# Altium schematic sheet 14.SchDoc
size 297 x 209 mm
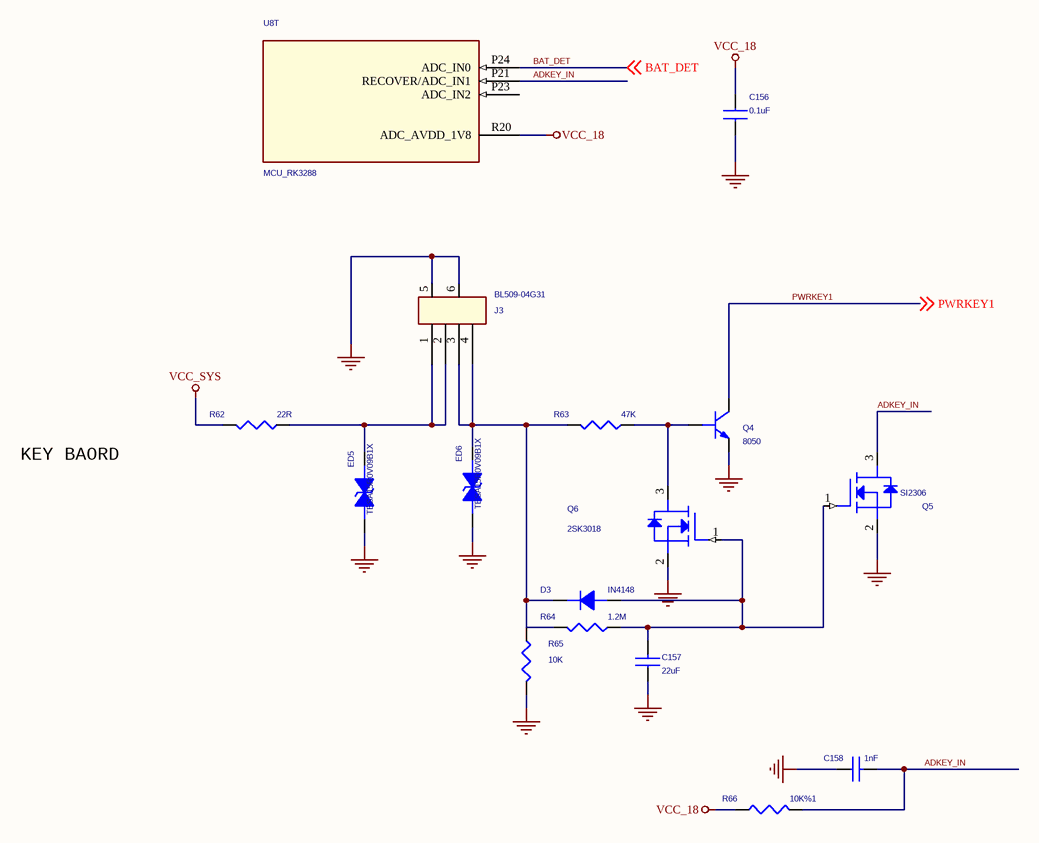
[diagram p0: 14.SchDoc]

## Parts
C156  0.1uF  [C0603]
C157  22uF  [C0402]
C158  1nF  [C0402]
D3  IN4148  [SOD323]
ED5  TESA15R0V09B1X  [E0402N]
ED6  TESA15R0V09B1X  [E0402N]
J3  BL509-04G31  [BL509-04G31]
Q4  8050  [SOT23]
Q5  SI2306  [SOT23]
Q6  2SK3018  [SOT23]
R62  22R  [R0402]
R63  47K  [R0402]
R64  1.2M  [R0402]
R65  10K  [R0402]
R66  10K%1  [R0402]
U8  MCU_RK3288  [BGA453-19X19]  (part T of 24)

## Nets
GND: C156.1 C157.1 C158.1 ED5.2 ED6.2 J3.5 J3.6 Q4.2(E) Q5.2(SOURCE) Q6.2(SOURCE) R65.2
VCC_18: C156.2 R66.1 U8.R20(ADC_AVDD_1V8)
VCC_SYS: R62.2
ADKEY_IN: C158.2 Q5.3(DRAIN) R66.2 U8.P21(RECOVER/ADC_IN1)
BAT_DET: U8.P24(ADC_IN0) ; off-sheet BAT_DET
PWRKEY1: Q4.3(C) ; off-sheet PWRKEY1
NetC157_2: C157.2 D3.1(A) Q5.1(GATE) Q6.1(GATE) R64.1
NetD3_2: D3.2(K) ED6.1 J3.3 J3.4 R63.2 R64.2 R65.1
NetED5_1: ED5.1 J3.1 J3.2 R62.1
NetQ4_1: Q4.1(B) Q6.3(DRAIN) R63.1

Not connected (* = marked no-connect by the designer): U8 P23(ADC_IN2)

## Notes on the sheet
- KEY BAORD

## Library data of the parts
C156 = CAP NP_Dup3: 贴片电容; MARK: 106; ROOM: USB+5V
C157 = CAP NP_Dup2: RoHS CHIP CAP 4.7uF 25V +10/-10% 16V X7R; MARK: 106; ROOM: USB+5V
C158 = CAP NP_Dup2: RoHS CHIP CAP 1nF +10/-10% X7R
D3 = DIODE_Dup1: Diode,Schottky,1N5819HW,40V,500mA,450mV,SOD-323; Supplier P/N: 1N5819HW; Supplier: DIODES
ED5 ED6 = TVS: ESD Component,5V,30P,SMD,0402
J3 = CON4_0
Q4 = 40852_1: Trans NPN,SS8050,25V,1500mA,10~60@Vce=1V,Ic=500mA, SOT-23
Q5 Q6 = MOSFET N: MOSFET-N,WNM2021 ,20V,+/-8V,0.8A,300m Ohm@Vgs=4.5V,SOT23
R62-R65 = RESISTOR_Dup1: ROHS CHIP RES 51K 1/16W ±5%
R66 = RESISTOR_Dup1: ROHS CHIP RES 10K 1/16W +/-1%
U8 = MCU_RK3288_3